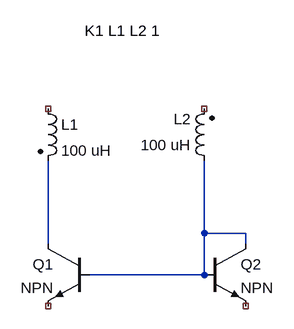
[diagram p0: schematic nic1.asc]
nic1.asc, the LTspice schematic file:
Version 4
SHEET 1 880 680
WIRE 368 144 368 32
WIRE 432 144 368 144
WIRE 128 160 128 32
WIRE 432 160 432 144
WIRE 368 208 368 144
WIRE 368 208 192 208
SYMBOL npn 192 160 M0
SYMATTR InstName Q1
SYMBOL npn 368 160 R0
SYMATTR InstName Q2
SYMBOL ind2 112 -64 R0
SYMATTR InstName L1
SYMATTR Value 100 uH
SYMATTR Type ind
SYMBOL ind2 384 48 R180
WINDOW 0 36 80 Left 2
WINDOW 3 36 40 Left 2
SYMATTR InstName L2
SYMATTR Value 100 uH
SYMATTR Type ind
TEXT 184 -168 Left 2 !K1 L1 L2 1

The netlist it stands for:
* nic1.asc
Q1 N002 N001 NC_01 0 NPN
Q2 N001 N001 NC_02 0 NPN
L1 NC_03 N002 100 uH
L2 N001 NC_04 100 uH
.model NPN NPN
.model PNP PNP
.lib standard.bjt
K1 L1 L2 1
.backanno
.end